# Altium schematic sheet SN74LVC4245A.SchDoc
size A4; Organization: Altium Limited; Address1: L3, 12a Rodborough Rd; Address2: Frenchs Forest; Address3: NSW; Address4: Australia 2086; SheetNumber: 5; SheetTotal: 8
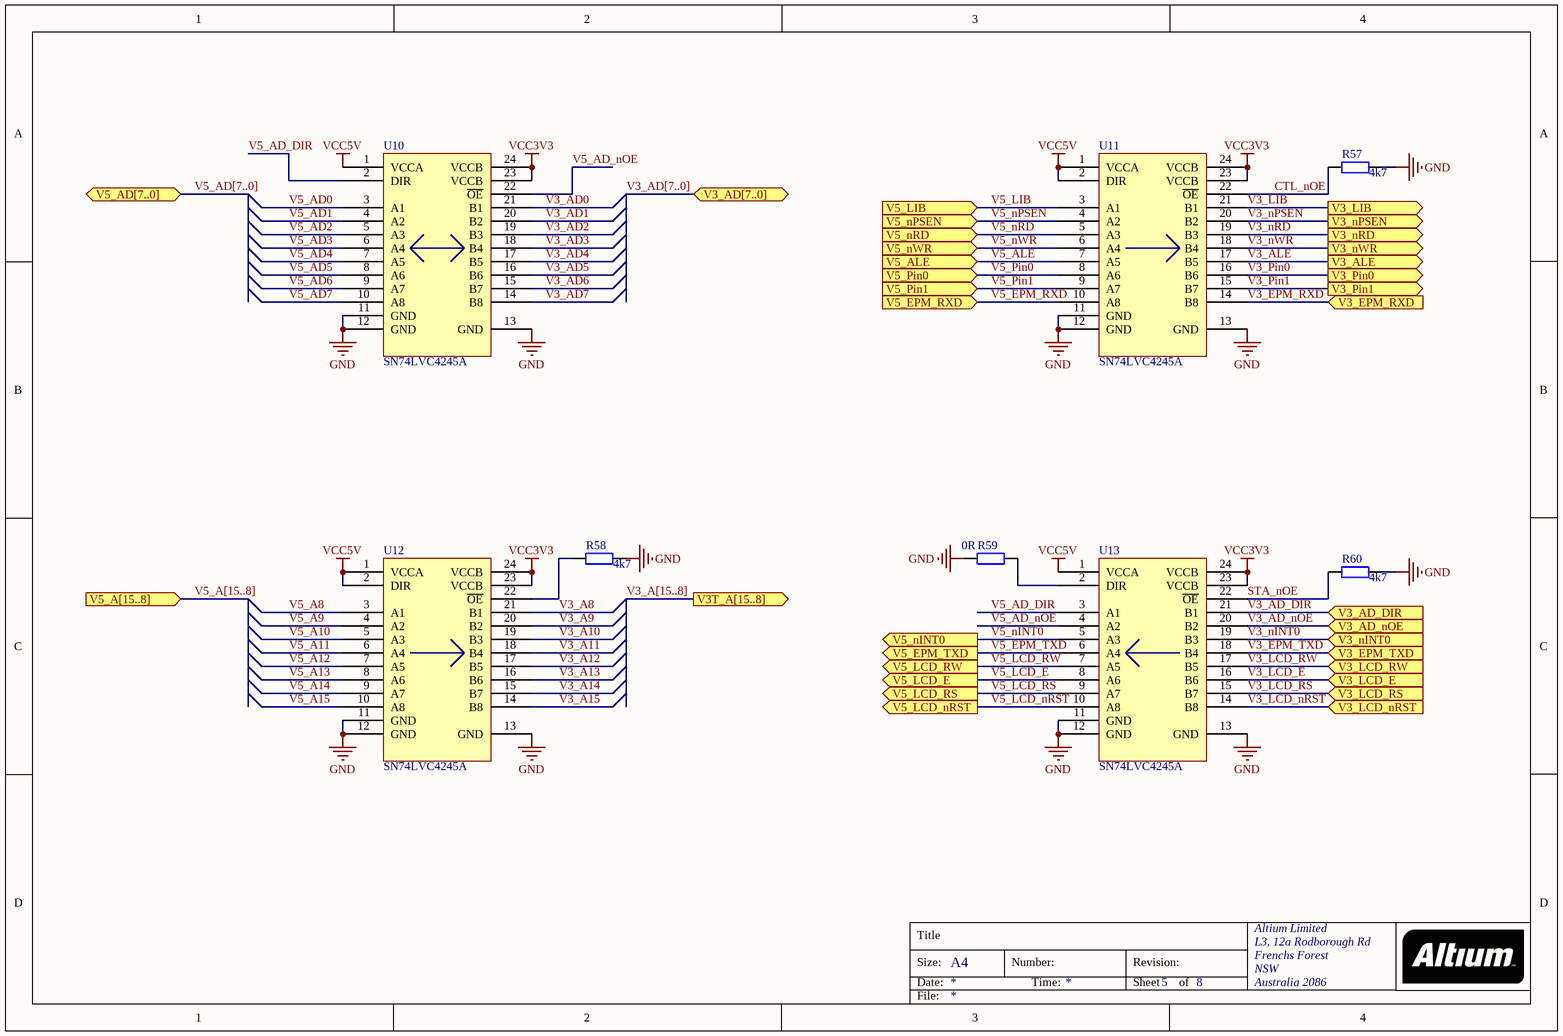
[diagram p0: SN74LVC4245A.SchDoc]

## Parts
R57  4k7  [R0603]
R58  4k7  [R0603]
R59  0R  [R0603]
R60  4k7  [R0603]
U10  SN74LVC4245A  [TSSOP-24]
U11  SN74LVC4245A  [TSSOP-24]
U12  SN74LVC4245A  [TSSOP-24]
U13  SN74LVC4245A  [TSSOP-24]

## Ports
V3_AD[7..0] (bidir), V3_AD_DIR (in), V3_AD_nOE (in), V3_ALE (out), V3_EPM_RXD (in), V3_EPM_TXD (in), V3_LCD_E (in), V3_LCD_nRST (in), V3_LCD_RS (in), V3_LCD_RW (in), V3_LIB (out), V3_nINT0 (in), V3_nPSEN (out), V3_nRD (out), V3_nWR (out), V3_Pin0 (out), V3_Pin1 (out), V3T_A[15..8] (out), V5_A[15..8] (in), V5_AD[7..0] (bidir), V5_ALE (in), V5_EPM_RXD (in), V5_EPM_TXD (out), V5_LCD_E (out), V5_LCD_nRST (out), V5_LCD_RS (out), V5_LCD_RW (out), V5_LIB (in), V5_nINT0 (out), V5_nPSEN (in), V5_nRD (in), V5_nWR (in), V5_Pin0 (in), V5_Pin1 (in)

## Nets
GND: R57.1 R58.1 R59.2 R60.1 U10.11(GND) U10.12(GND) U10.13(GND) U11.11(GND) U11.12(GND) U11.13(GND) U12.11(GND) U12.12(GND) U12.13(GND) U13.11(GND) U13.12(GND) U13.13(GND)
VCC3V3: U10.23(VCCB) U10.24(VCCB) U11.23(VCCB) U11.24(VCCB) U12.23(VCCB) U12.24(VCCB) U13.23(VCCB) U13.24(VCCB)
VCC5V: U10.1(VCCA) U11.1(VCCA) U11.2(DIR) U12.1(VCCA) U12.2(DIR) U13.1(VCCA)
CTL_nOE: R57.2 U11.22(~{OE})
STA_nOE: R60.2 U13.22(~{OE})
V3_A8: U12.21(B1)
V3_A9: U12.20(B2)
V3_A10: U12.19(B3)
V3_A11: U12.18(B4)
V3_A12: U12.17(B5)
V3_A13: U12.16(B6)
V3_A14: U12.15(B7)
V3_A15: U12.14(B8)
V3_AD0: U10.21(B1)
V3_AD1: U10.20(B2)
V3_AD2: U10.19(B3)
V3_AD3: U10.18(B4)
V3_AD4: U10.17(B5)
V3_AD5: U10.16(B6)
V3_AD6: U10.15(B7)
V3_AD7: U10.14(B8)
V3_AD_DIR: U13.21(B1) ; port V3_AD_DIR
V3_AD_nOE: U13.20(B2) ; port V3_AD_nOE
V3_ALE: U11.17(B5) ; port V3_ALE
V3_EPM_RXD: U11.14(B8) ; port V3_EPM_RXD
V3_EPM_TXD: U13.18(B4) ; port V3_EPM_TXD
V3_LCD_E: U13.16(B6) ; port V3_LCD_E
V3_LCD_nRST: U13.14(B8) ; port V3_LCD_nRST
V3_LCD_RS: U13.15(B7) ; port V3_LCD_RS
V3_LCD_RW: U13.17(B5) ; port V3_LCD_RW
V3_LIB: U11.21(B1) ; port V3_LIB
V3_nINT0: U13.19(B3) ; port V3_nINT0
V3_nPSEN: U11.20(B2) ; port V3_nPSEN
V3_nRD: U11.19(B3) ; port V3_nRD
V3_nWR: U11.18(B4) ; port V3_nWR
V3_Pin0: U11.16(B6) ; port V3_Pin0
V3_Pin1: U11.15(B7) ; port V3_Pin1
V5_A8: U12.3(A1)
V5_A9: U12.4(A2)
V5_A10: U12.5(A3)
V5_A11: U12.6(A4)
V5_A12: U12.7(A5)
V5_A13: U12.8(A6)
V5_A14: U12.9(A7)
V5_A15: U12.10(A8)
V5_AD0: U10.3(A1)
V5_AD1: U10.4(A2)
V5_AD2: U10.5(A3)
V5_AD3: U10.6(A4)
V5_AD4: U10.7(A5)
V5_AD5: U10.8(A6)
V5_AD6: U10.9(A7)
V5_AD7: U10.10(A8)
V5_AD_DIR: U10.2(DIR) U13.3(A1)
V5_AD_nOE: U10.22(~{OE}) U13.4(A2)
V5_ALE: U11.7(A5) ; port V5_ALE
V5_EPM_RXD: U11.10(A8) ; port V5_EPM_RXD
V5_EPM_TXD: U13.6(A4) ; port V5_EPM_TXD
V5_LCD_E: U13.8(A6) ; port V5_LCD_E
V5_LCD_nRST: U13.10(A8) ; port V5_LCD_nRST
V5_LCD_RS: U13.9(A7) ; port V5_LCD_RS
V5_LCD_RW: U13.7(A5) ; port V5_LCD_RW
V5_LIB: U11.3(A1) ; port V5_LIB
V5_nINT0: U13.5(A3) ; port V5_nINT0
V5_nPSEN: U11.4(A2) ; port V5_nPSEN
V5_nRD: U11.5(A3) ; port V5_nRD
V5_nWR: U11.6(A4) ; port V5_nWR
V5_Pin0: U11.8(A6) ; port V5_Pin0
V5_Pin1: U11.9(A7) ; port V5_Pin1
NetR58_2: R58.2 U12.22(~{OE})
NetR59_1: R59.1 U13.2(DIR)

## Buses and harness runs
bus V3_A[15..8] = port V3T_A[15..8]
bus V3_AD[7..0] = port V3_AD[7..0]
bus V5_A[15..8] = port V5_A[15..8]
bus V5_AD[7..0] = port V5_AD[7..0]

## Notes on the sheet
- Title
- Size:
- Date:
- A4
- Number:
- Time:
- Revision:
- Sheet
- of
- File:

## Library data of the parts
R57-R60 = RES_04
  R57 R58 R60: Value: 4k7
  R59: Value: 0R
U10-U13 = SN74LVC4245A-SOIC